# EAGLE design nixieWatchV0 (EAGLE 7.4.0)
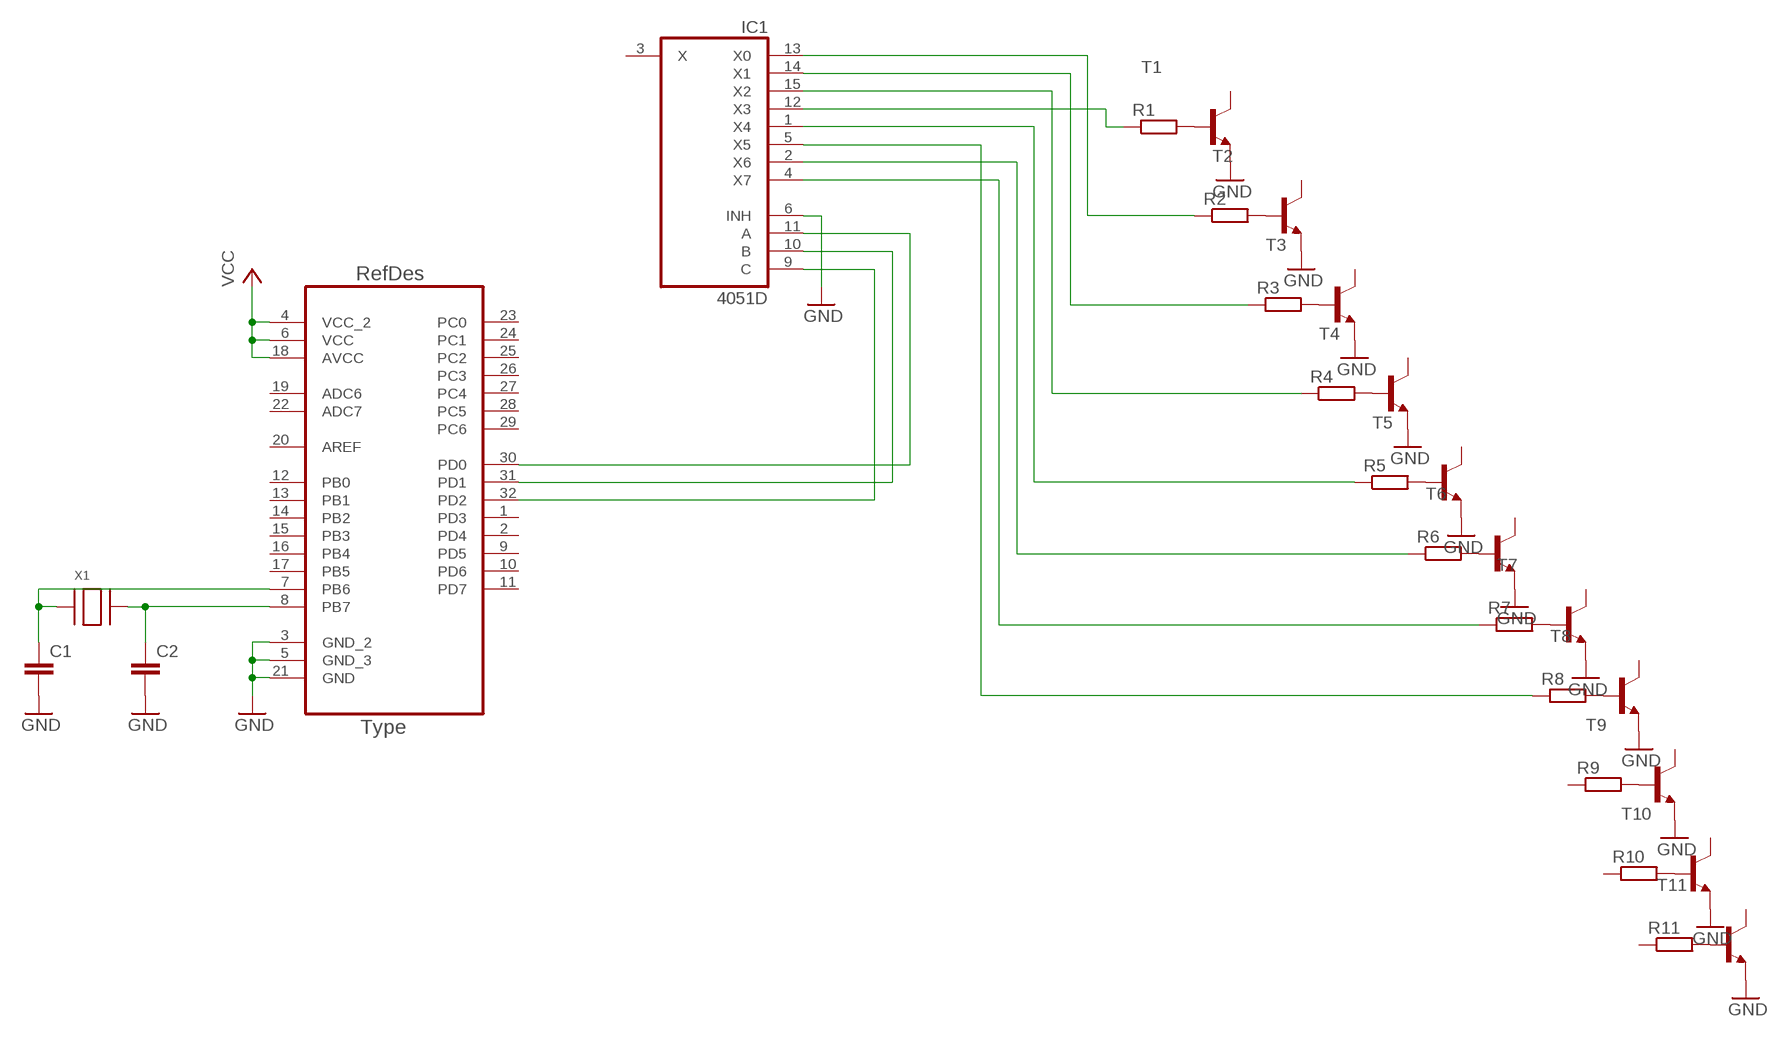
[diagram p0: schematic, sheet 1]

## Parts
C1  C-EUC0402  [C0402]
C2  C-EUC0402  [C0402]
IC1  4051D  [SO16]
R1  R-EU_M1206  [M1206]
R2  R-EU_M1206  [M1206]
R3  R-EU_M1206  [M1206]
R4  R-EU_M1206  [M1206]
R5  R-EU_M1206  [M1206]
R6  R-EU_M1206  [M1206]
R7  R-EU_M1206  [M1206]
R8  R-EU_M1206  [M1206]
R9  R-EU_M1206  [M1206]
R10  R-EU_M1206  [M1206]
R11  R-EU_M1206  [M1206]
T1  -NPN-SOT23-EBC  [SOT23-EBC]
T2  -NPN-SOT23-EBC  [SOT23-EBC]
T3  -NPN-SOT23-EBC  [SOT23-EBC]
T4  -NPN-SOT23-EBC  [SOT23-EBC]
T5  -NPN-SOT23-EBC  [SOT23-EBC]
T6  -NPN-SOT23-EBC  [SOT23-EBC]
T7  -NPN-SOT23-EBC  [SOT23-EBC]
T8  -NPN-SOT23-EBC  [SOT23-EBC]
T9  -NPN-SOT23-EBC  [SOT23-EBC]
T10  -NPN-SOT23-EBC  [SOT23-EBC]
T11  -NPN-SOT23-EBC  [SOT23-EBC]
U1  ATMEGA328P-AU  [QFP80P900X900X120-32N]
X1  XTAL-3.2X1.5  [XTAL3215]

## Nets
GND: C1.2 C2.2 IC1.6(INH) T1.E T2.E T3.E T4.E T5.E T6.E T7.E T8.E T9.E T10.E T11.E U1.3(GND_2) U1.5(GND_3) U1.21(GND)
N$1: R1.2 T1.B
N$2: R2.2 T2.B
N$3: R3.2 T3.B
N$4: R4.2 T4.B
N$5: R5.2 T5.B
N$6: R6.2 T6.B
N$7: R7.2 T7.B
N$8: R8.2 T8.B
N$9: R9.2 T9.B
N$10: R10.2 T10.B
N$11: R11.2 T11.B
N$12: IC1.12(X3) R1.1
N$13: C1.1 U1.7(PB6) X1.P$1
N$14: C2.1 U1.8(PB7) X1.P$2
N$15: IC1.13(X0) R2.1
N$16: IC1.14(X1) R3.1
N$17: IC1.15(X2) R4.1
N$18: IC1.1(X4) R5.1
N$19: IC1.2(X6) R6.1
N$20: IC1.4(X7) R7.1
N$21: IC1.10(B) U1.31(PD1)
N$22: IC1.5(X5) R8.1
N$24: IC1.11(A) U1.30(PD0)
N$25: IC1.9(C) U1.32(PD2)
VCC: U1.4(VCC_2) U1.6(VCC) U1.18(AVCC)
Unconnected: IC1.3(X) R9.1 R10.1 R11.1 T1.C T2.C T3.C T4.C T5.C T6.C T7.C T8.C T9.C T10.C T11.C U1.1(PD3) U1.2(PD4) U1.9(PD5) U1.10(PD6) U1.11(PD7) U1.12(PB0) U1.13(PB1) U1.14(PB2) U1.15(PB3) U1.16(PB4) U1.17(PB5) U1.19(ADC6) U1.20(AREF) U1.22(ADC7) U1.23(PC0) U1.24(PC1) U1.25(PC2) U1.26(PC3) U1.27(PC4) U1.28(PC5) U1.29(PC6)

## Power pins joined to a net without a drawn wire
GND: IC1.8(GND)
VCC: IC1.16(VCC)
VEE: IC1.7(VEE)

## Library data of the parts
C1 C2 = rcl:C-EU: CAPACITOR, European symbol
IC1 = 40xx:4051: 8-channel ANALOG MULTIPLEXER
R1-R11 = rcl:R-EU_: RESISTOR, European symbol
T1-T11 = transistor:*-NPN-: NPN Transistror BF959 corrected 2008.03.06
U1 = Atmega328pAU:ATMEGA328P-AU; DESCRIPTION: 8-bit Microcontroller with In-System Programmable Flash; MPN: ATMEGA328P-AU; OC_FARNELL: 1715486; OC_NEWARK: 14R4631; PACKAGE: TQFP-32; SUPPLIER: Atmel
X1 = adafruit:XTAL: Low cost SMT crystals, no capacitors included http://www.ladyada.net/library/eagle

## Board
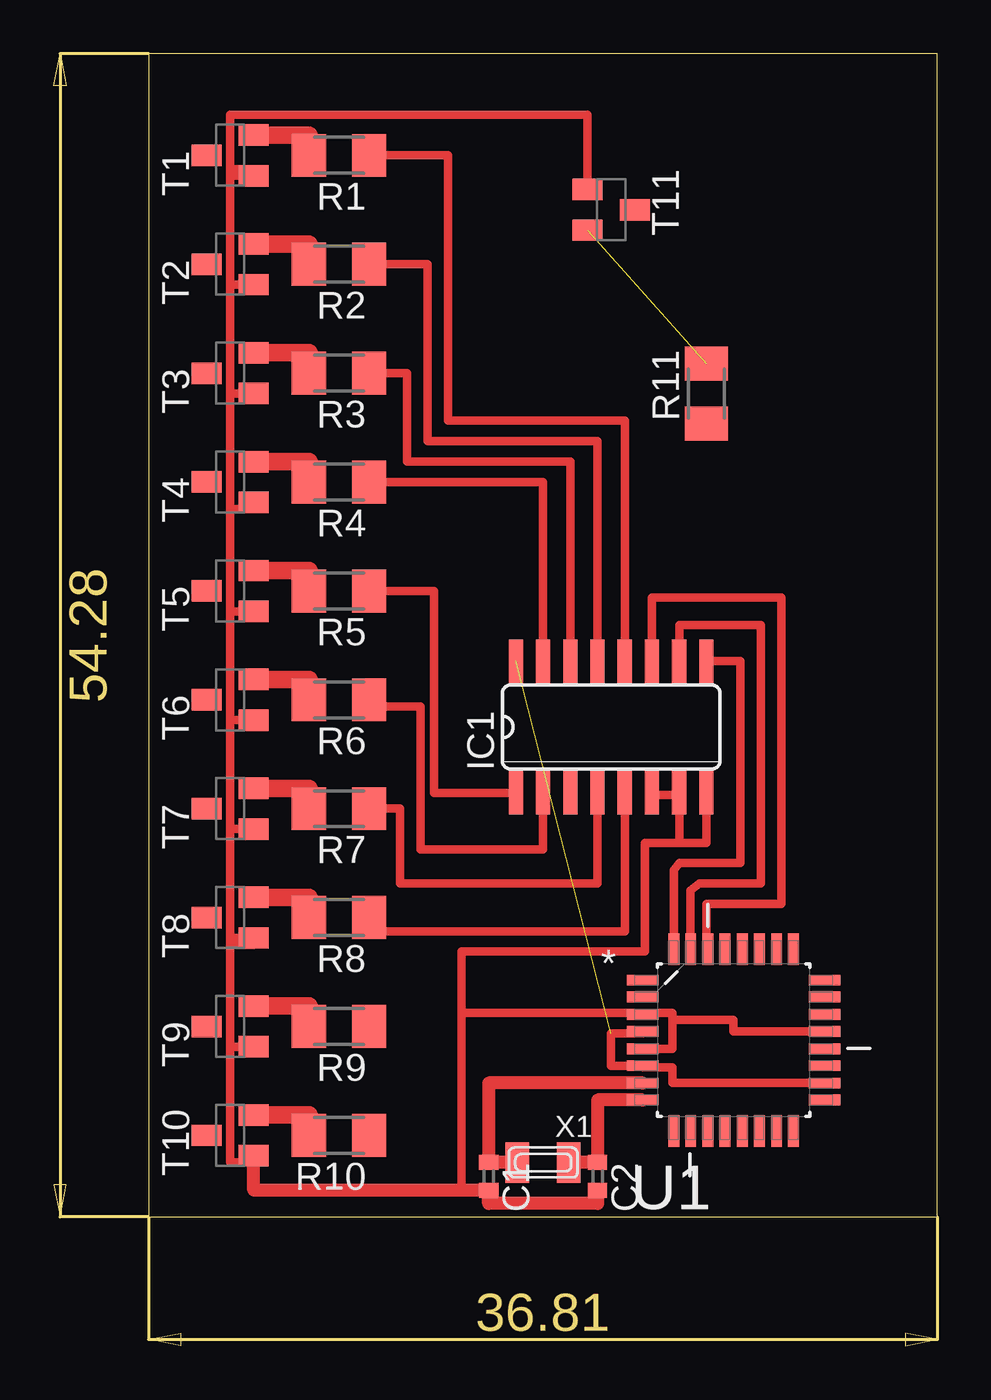
[diagram p1: board, top side]

Size 36.81 x 54.28 mm. Coordinates in mm from the lower left corner, seen from the top.
Outline: 0,0 36.81,0 36.81,54.28 0,54.28 0,0
Copper layers (1*16): Top 0.035mm / dielectric 1.5mm / Bottom 0.035mm
Design rules "default": minimum track width 10mil, minimum drill 24mil, track to track 8mil, track to pad 8mil, pad to pad 8mil, via to via 8mil, smd to smd 8mil, copper to edge 40mil, drill to drill 8mil, minimum pad ring 10mil, minimum via ring 8mil, stop-mask expansion 4mil, vias tented up to drill 0mil, thermal gap 10mil

### Footprints (pad centres in the part's own frame; a part is rotated, then mirrored left to right if it is on the bottom)
C0402 = smd 0.7 x 0.9: 1 -0.65,0; 2 0.65,0
SO16 = smd 0.66 x 2.032: 1 -4.445,-3.073; 2 -3.175,-3.073; 3 -1.905,-3.073; 4 -0.635,-3.073; 5 0.635,-3.073; 6 1.905,-3.073; 7 3.175,-3.073; 8 4.445,-3.073; 9 4.445,3.073; 10 3.175,3.073; 11 1.905,3.073; 12 0.635,3.073; 13 -0.635,3.073; 14 -1.905,3.073; 15 -3.175,3.073; 16 -4.445,3.073
M1206 = smd 1.6 x 2: 1 -1.4,0; 2 1.4,0
SOT23-EBC = smd 1 x 1.4: B 0.95,-1.1; C 0,1.1; E -0.95,-1.1
QFP80P900X900X120-32N = smd 1.473 x 0.508: 1 -4.242,2.794; 2 -4.242,2.007; 3 -4.242,1.194; 4 -4.242,0.406; 5 -4.242,-0.406; 6 -4.242,-1.194; 7 -4.242,-2.007; 8 -4.242,-2.794; 17 4.242,-2.794; 18 4.242,-2.007; 19 4.242,-1.194; 20 4.242,-0.406; 21 4.242,0.406; 22 4.242,1.194; 23 4.242,2.007; 24 4.242,2.794 | smd 0.508 x 1.473: 9 -2.794,-4.242; 10 -2.007,-4.242; 11 -1.194,-4.242; 12 -0.406,-4.242; 13 0.406,-4.242; 14 1.194,-4.242; 15 2.007,-4.242; 16 2.794,-4.242; 25 2.794,4.242; 26 2.007,4.242; 27 1.194,4.242; 28 0.406,4.242; 29 -0.406,4.242; 30 -1.194,4.242; 31 -2.007,4.242; 32 -2.794,4.242
XTAL3215 = smd 1.1 x 1.9: P$1 1.2,0; P$2 -1.2,0

### Placement (x,y rotation side)
C1  15.88,1.91 270 top
C2  20.95,1.91 270 top
IC1  21.59,22.86 0 top
R1  8.89,49.53 180 top
R2  8.89,44.45 180 top
R3  8.89,39.37 180 top
R4  8.89,34.29 180 top
R5  8.89,29.21 180 top
R6  8.89,24.13 180 top
R7  8.89,19.05 180 top
R8  8.89,13.97 180 top
R9  8.89,8.89 180 top
R10  8.89,3.81 180 top
R11  26.04,38.42 90 top
T1  3.81,49.53 90 top
T2  3.81,44.45 90 top
T3  3.81,39.37 90 top
T4  3.81,34.29 90 top
T5  3.81,29.21 90 top
T6  3.81,24.13 90 top
T7  3.81,19.05 90 top
T8  3.81,13.97 90 top
T9  3.81,8.89 90 top
T10  3.81,3.81 90 top
T11  21.59,46.99 270 top
U1  27.3,8.26 0 top
X1  18.41,2.54 180 top

### Tracks (layer width: path | path; a pad name or v marks a point on that pad's centre or on a via)
GND
  Top 0.406: 3.81,7.94 3.81,2.54 4.91,2.54 T10.E | T9.E 3.81,7.94 | 3.81,7.94 3.81,12.7 | 3.81,12.7 4.91,12.7 T8.E 3.81,13.02 | 3.81,13.02 3.81,12.7 | 3.81,13.02 3.81,18.1 | 3.81,18.1 3.81,23.18 | 3.81,23.18 3.81,28.26 | 3.81,28.26 3.81,33.02 | 3.81,38.42 3.81,43.5 | 3.81,43.5 3.81,48.9 4.91,48.9 T1.E 3.81,48.58 3.81,51.44 20.49,51.44 T11.E | T2.E 3.81,43.5 | T3.E 3.81,38.42 | 3.81,38.42 3.81,33.02 | 3.81,33.02 4.91,33.02 T4.E | T5.E 3.81,28.26 | T6.E 3.81,23.18 | T7.E 3.81,18.1 | U1.21 27.3,8.66 27.3,9.21 24.45,9.21 | 24.45,9.21 24.45,9.53 23.06,9.53 | 23.06,9.53 U1.3 | 14.61,9.53 14.61,1.25 | U1.5 24.45,7.85 24.45,9.21 | 23.06,9.53 14.61,9.53 | IC1.8 26.04,17.46 24.77,17.46 | 14.61,9.53 14.61,12.38 23.18,12.38 23.18,17.46 24.77,17.46 | 24.77,17.46 24.77,19.68 23.5,19.68 IC1.6
  Top 0.61: C2.2 20.95,0.64 15.88,0.64 C1.2 14.61,1.25 4.91,1.25 T10.E
N$1
  Top 0.813: T1.B 7.49,50.48 R1.2
N$2
  Top 0.813: T2.B 7.49,45.4 R2.2
N$3
  Top 0.813: T3.B 7.49,40.32 R3.2
N$4
  Top 0.813: T4.B 7.49,35.24 R4.2
N$5
  Top 0.813: T5.B 7.49,30.16 R5.2
N$6
  Top 0.813: T6.B 7.49,25.08 R6.2
N$7
  Top 0.813: T7.B 7.49,20 R7.2
N$8
  Top 0.813: T8.B 7.49,14.92 R8.2
N$9
  Top 0.813: T9.B 7.49,9.84 R9.2
N$10
  Top 0.813: T10.B 7.49,4.76 R10.2
N$11  (1 unrouted)
N$12
  Top 0.406: R1.1 13.97,49.53 13.97,37.15 22.23,37.15 IC1.12
N$13
  Top 0.61: X1.P$1 15.88,2.54 C1.1 15.88,6.25 U1.7
N$14
  Top 0.61: X1.P$2 19.61,2.56 C2.1 20.95,5.46 U1.8
N$15
  Top 0.406: IC1.13 20.95,36.2 13.02,36.2 13.02,44.45 R2.1
N$16
  Top 0.406: R3.1 12.06,39.37 12.06,35.24 19.68,35.24 IC1.14
N$17
  Top 0.406: IC1.15 18.41,34.29 R4.1 9.84,34.29
N$18
  Top 0.406: IC1.1 13.34,19.79 13.34,29.21 R5.1
N$19
  Top 0.406: IC1.2 18.41,17.14 12.7,17.14 12.7,23.81 10.29,23.81 R6.1
N$20
  Top 0.406: IC1.4 20.95,15.56 11.75,15.56 11.75,19.05 R7.1
N$21
  Top 0.406: IC1.10 24.77,27.62 28.57,27.62 28.57,15.56 25.72,15.56 25.3,15.24 U1.31
N$22
  Top 0.406: IC1.5 22.23,13.34 10.29,13.34 R8.1
N$24
  Top 0.406: U1.30 26.04,12.5 26.04,14.61 29.53,14.61 29.53,28.89 23.5,28.89 IC1.11
N$25
  Top 0.406: IC1.9 27.62,25.93 27.62,16.51 24.77,16.51 24.51,16.19 U1.32
VCC  (1 unrouted)
  Top 0.406: U1.4 23.06,8.57 21.59,8.57 21.59,7.06 U1.6 23.06,6.99 24.45,6.99 24.45,6.25 U1.18